# EAGLE design LCD_Backpack_1.8_TFT.v2 (EAGLE 5.07)
PROJECT: USB 1,8" TFT BREAKOUT V2
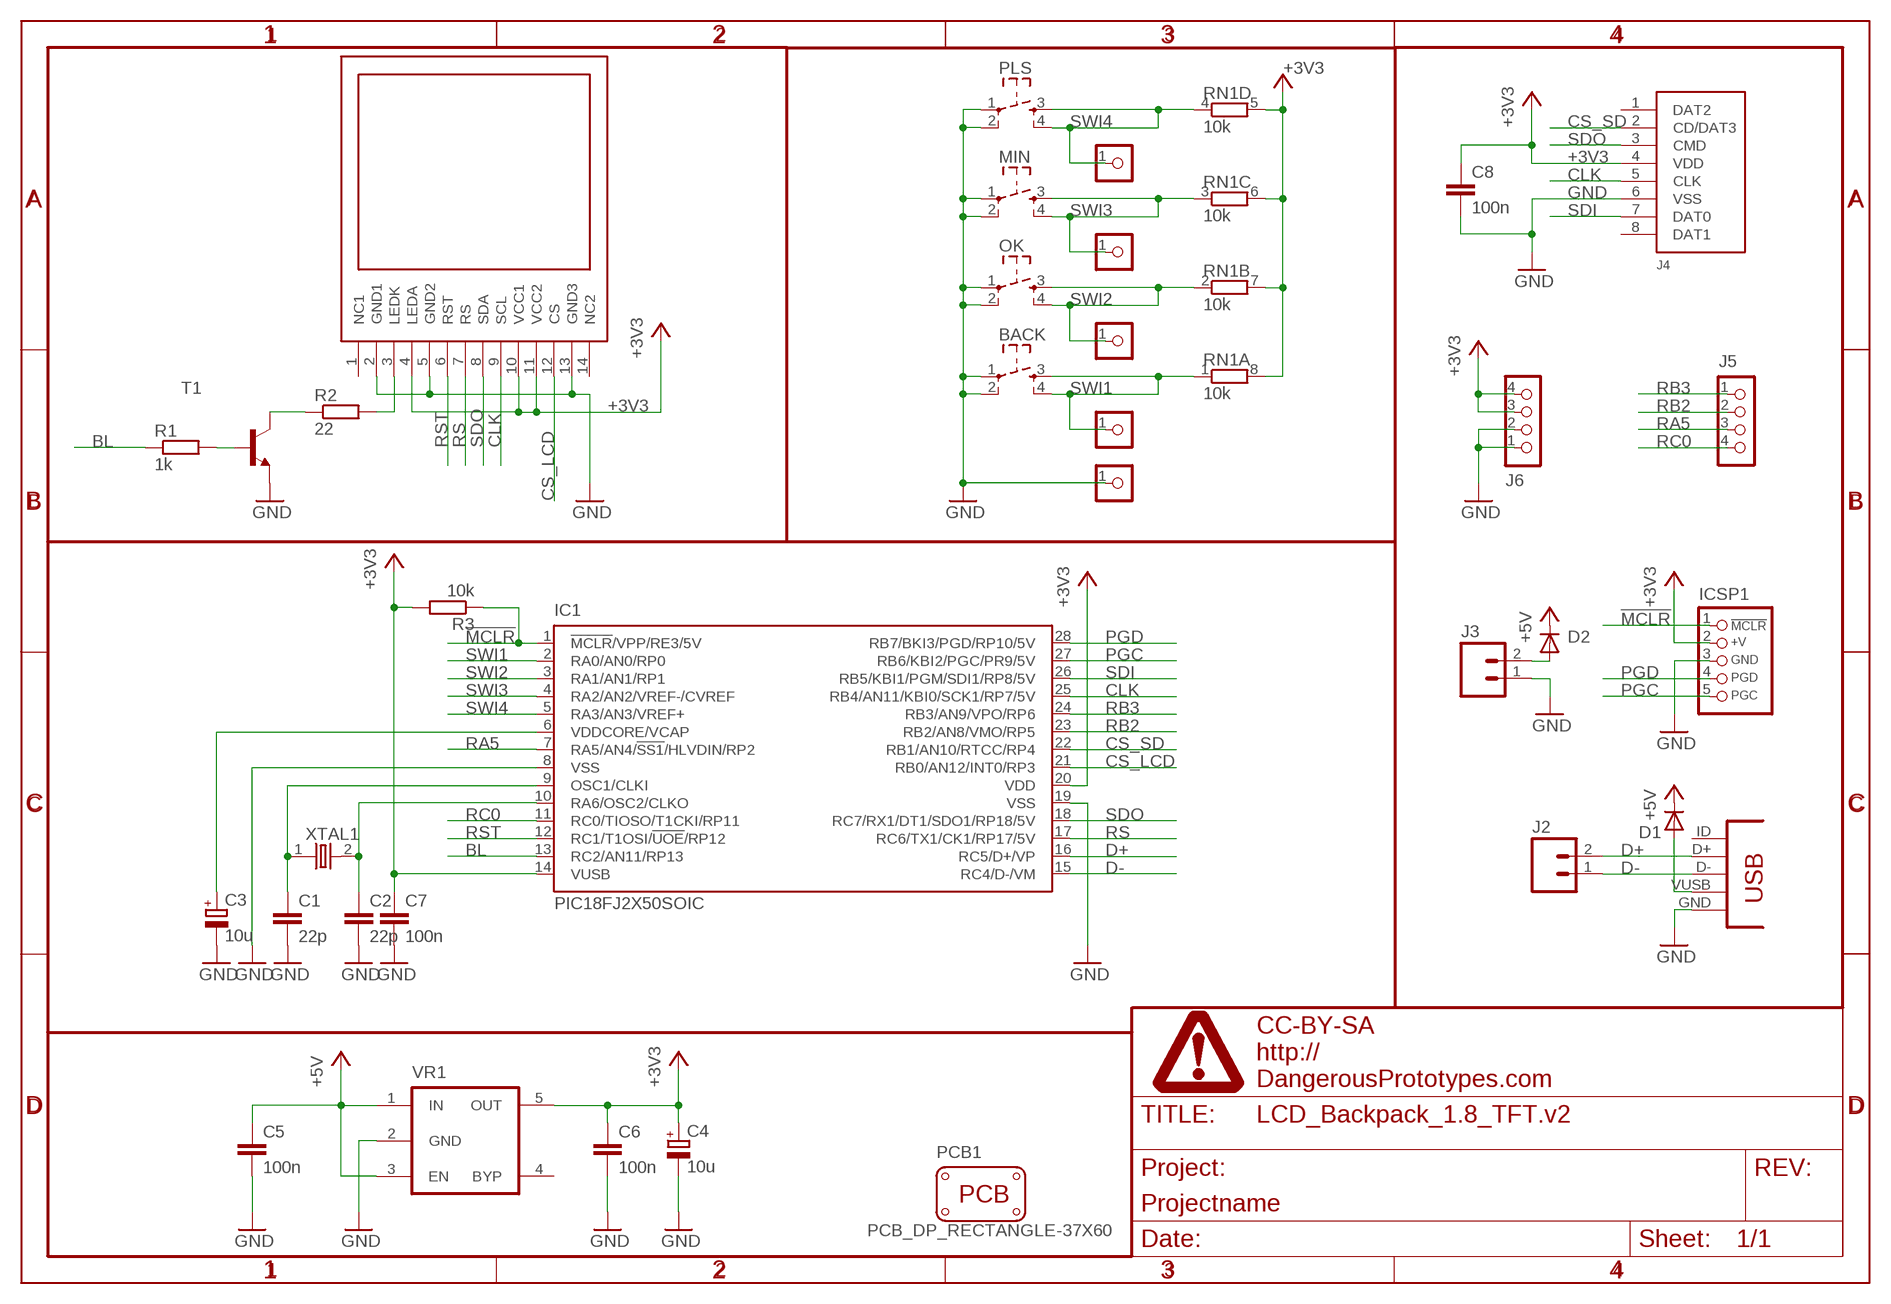
[diagram p0: schematic, sheet 1]

## Parts
BACK  SW_TACT_4P  [SW_TACT_SMALL]
C1  22p  CAPC603  [C603]
C2  22p  CAPC603  [C603]
C3  10u  CAP_POLSMC_A  [SMC_A]
C4  10u  CAP_POLSMC_A  [SMC_A]
C5  100n  CAPC603  [C603]
C6  100n  CAPC603  [C603]
C7  100n  CAPC603  [C603]
C8  100n  CAPC603  [C603]
D1  DIODE-SOD-123  [SOD-123]
D2  DIODE-SOD-123  [SOD-123]
IC1  PIC18FJ2X50SOIC  [SOIC28W]
ICSP1  HEADER_PRG_PIC_ICSPB  [HEADER_PRG_1X05_ICSP_B]
J1  CON-USB-MINI-BUSB1  [CONN_USB_MINI-B]
J2  M02PTH  [1X02]
J3  M02PTH  [1X02]
J4  CON_MICROSDHINGED  [CON_MICROSD_HINGED]
J5  CON_HEADER_1X04  [M1X4]
J6  CON_HEADER_1X04  [M1X4]
J7  CON_HEADER_1X01-PTH  [M1X1]
J8  CON_HEADER_1X01-PTH  [M1X1]
J9  CON_HEADER_1X01-PTH  [M1X1]
J10  CON_HEADER_1X01-PTH  [M1X1]
J11  CON_HEADER_1X01-PTH  [M1X1]
MIN  SW_TACT_4P  [SW_TACT_SMALL]
OK  SW_TACT_4P  [SW_TACT_SMALL]
PCB1  PCB_DP_RECTANGLE-37X60  [DP6037_V1]
PLS  SW_TACT_4P  [SW_TACT_SMALL]
R1  1k  RESISTORR603  [R603]
R2  22  RESISTORR603  [R603]
R3  10k  RESISTORR603  [R603]
RN1  10k  RNETWORK  [RN8P-4R-CRA06S]
T1  BJT-NPNSOT23BEC  [SOT23-BEC]
U$1  LCD18  [LCD18]
U$4  DINA4_L  [DP_LOGO]
VR1  MIC5205  [SOT-23-5]
XTAL1  OSC-XTAL  [HC-49U]

## Nets
!MCLR: IC1.1(!MCLR!/VPP/RE3/5V) ICSP1.1(/MCLR) R3.1
+3V3: C4.+ C6.1 C7.1 C8.1 IC1.14(VUSB) IC1.20(VDD) ICSP1.2(+V) J4.4(VDD) J6.3 J6.4 R3.2 RN1.5 RN1.6 RN1.7 RN1.8 U$1.4(LEDA) U$1.10(VCC1) U$1.11(VCC2) VR1.5(OUT)
+5V: C5.1 D1.C D2.C VR1.1(IN) VR1.3(EN)
BL: IC1.13(RC2/AN11/RP13) R1.1
CLK: IC1.25(RB4/AN11/KBI0/SCK1/RP7/5V) J4.5(CLK) U$1.9(SCL)
CS_LCD: IC1.21(RB0/AN12/INT0/RP3) U$1.12(CS)
CS_SD: IC1.22(RB1/AN10/RTCC/RP4) J4.2(CD/DAT3)
D+: IC1.16(RC5/D+/VP) J1.D+ J2.2
D-: IC1.15(RC4/D-/VM) J1.D- J2.1
GND: BACK.1 BACK.2 C1.2 C2.2 C3.- C4.- C5.2 C6.2 C7.2 C8.2 IC1.8(VSS) IC1.19(VSS) ICSP1.3(GND) J1.GND J3.1 J4.6(VSS) J6.1 J6.2 J11.1 MIN.1 MIN.2 OK.1 OK.2 PLS.1 PLS.2 T1.E U$1.2(GND1) U$1.5(GND2) U$1.13(GND3) VR1.2(GND)
N$1: C3.+ IC1.6(VDDCORE/VCAP)
N$2: D1.A J1.VUSB
N$3: D2.A J3.2
N$13: C1.1 IC1.9(OSC1/CLKI) XTAL1.1
N$14: C2.1 IC1.10(RA6/OSC2/CLKO) XTAL1.2
N$15: R2.1 T1.C
N$18: R2.2 U$1.3(LEDK)
N$19: R1.2 T1.B
PGC: IC1.27(RB6/KBI2/PGC/PR9/5V) ICSP1.5(PGC)
PGD: IC1.28(RB7/BKI3/PGD/RP10/5V) ICSP1.4(PGD)
RA5: IC1.7(RA5/AN4/!SS1!/HLVDIN/RP2) J5.3
RB2: IC1.23(RB2/AN8/VMO/RP5) J5.2
RB3: IC1.24(RB3/AN9/VPO/RP6) J5.1
RC0: IC1.11(RC0/TIOSO/T1CKI/RP11) J5.4
RS: IC1.17(RC6/TX1/CK1/RP17/5V) U$1.7(RS)
RST: IC1.12(RC1/T1OSI/!UOE!/RP12) U$1.6(RST)
SDI: IC1.26(RB5/KBI1/PGM/SDI1/RP8/5V) J4.7(DAT0)
SDO: IC1.18(RC7/RX1/DT1/SDO1/RP18/5V) J4.3(CMD) U$1.8(SDA)
SWI1: BACK.3 BACK.4 IC1.2(RA0/AN0/RP0) J10.1 RN1.1
SWI2: IC1.3(RA1/AN1/RP1) J9.1 OK.3 OK.4 RN1.2
SWI3: IC1.4(RA2/AN2/VREF-/CVREF) J8.1 MIN.3 MIN.4 RN1.3
SWI4: IC1.5(RA3/AN3/VREF+) J7.1 PLS.3 PLS.4 RN1.4
Unconnected: J1.BODY@1(BODY) J1.BODY@2(BODY) J1.BODY@3(BODY) J1.BODY@4(BODY) J1.ID(USBID) J4.1(DAT2) J4.8(DAT1) U$1.1(NC1) U$1.14(NC2) VR1.4(BYP)

## Library data of the parts
BACK MIN OK PLS = dp_devices:SW_TACT_4P
C1 C2 C5-C8 = dp_devices:CAP
C3 C4 = dp_devices:CAP_POL
D1 D2 = dp_devices:DIODE: Various Diode Packages
IC1 = dp_devices:PIC18FJ2X50
ICSP1 = dp_devices:HEADER_PRG_PIC_ICSP: 5-pin PIC In Circuit Serial Programming header
J1 = dp_devices:CON-USB-MINI-B: USB connector
J2 J3 = SparkFun2:M02: Header 2 Standard 2-pin 0.1" header. Use with straight break away headers (SKU : PRT-00116), right angle break away headers (PRT-00553), swiss pins (PRT-00743), machine pins (PRT-00117), and female headers (PRT-00115). Molex polarized connector foot print use with SKU : PRT-08233 with associated crimp pins and housings.
J4 = dp_devices:CON_MICROSD
J5 J6 = dp_devices:CON_HEADER_1X04
J7-J11 = dp_devices:CON_HEADER_1X01
PCB1 = dp_devices:PCB_DP_RECTANGLE: Dangerous Prototypes Standard Rectangular PCB sizes
R1-R3 = dp_devices:RESISTOR
RN1 = dp_devices:RNETWORK: 4 Resistor Array 0603
T1 = dp_devices:BJT-NPN: Most commonly used is SOT23-BEC
U$1 = lcd:LCD18
U$4 = dp_devices:DINA4_L: A4 DP frame Standard Dangerous Prototypes schematic frame. Automagically adds the DP logo and standard texts to the PCB Use the atrribute in the schematic editor to change the fields.; FF1: fulfillment by; FF2: Seeed Studio; FF3: www.seeedstudio.com; LICENSE: CC-BY-SA; PROJECT: Projectname; URL1: http://; URL2: DangerousPrototypes.com
VR1 = dp_devices:MIC5205: 150ma Low-Noise LDO Regulator
XTAL1 = dp_devices:OSC-XTAL

## Board
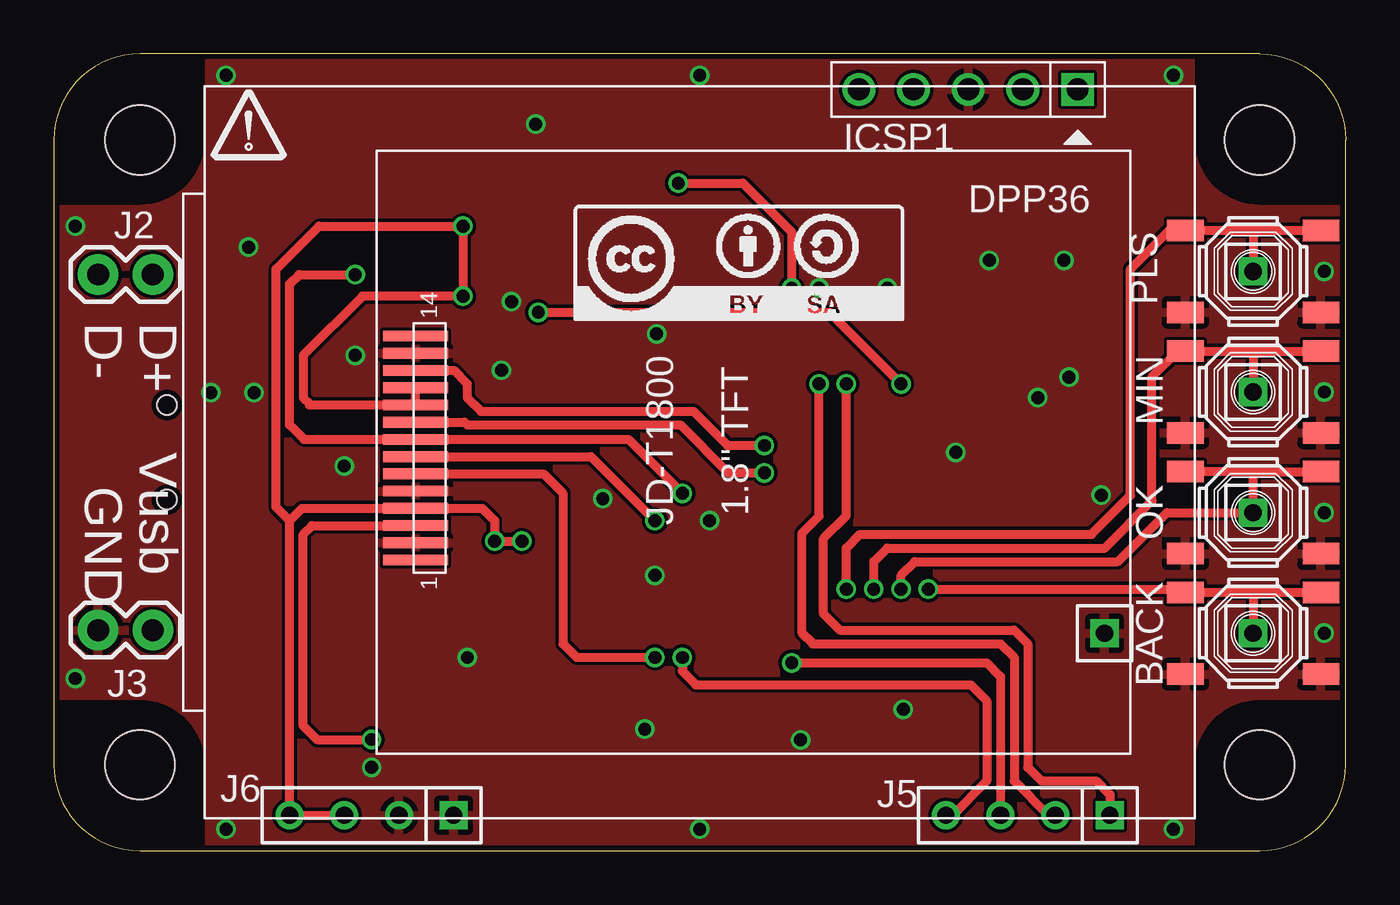
[diagram p1: board, top side]
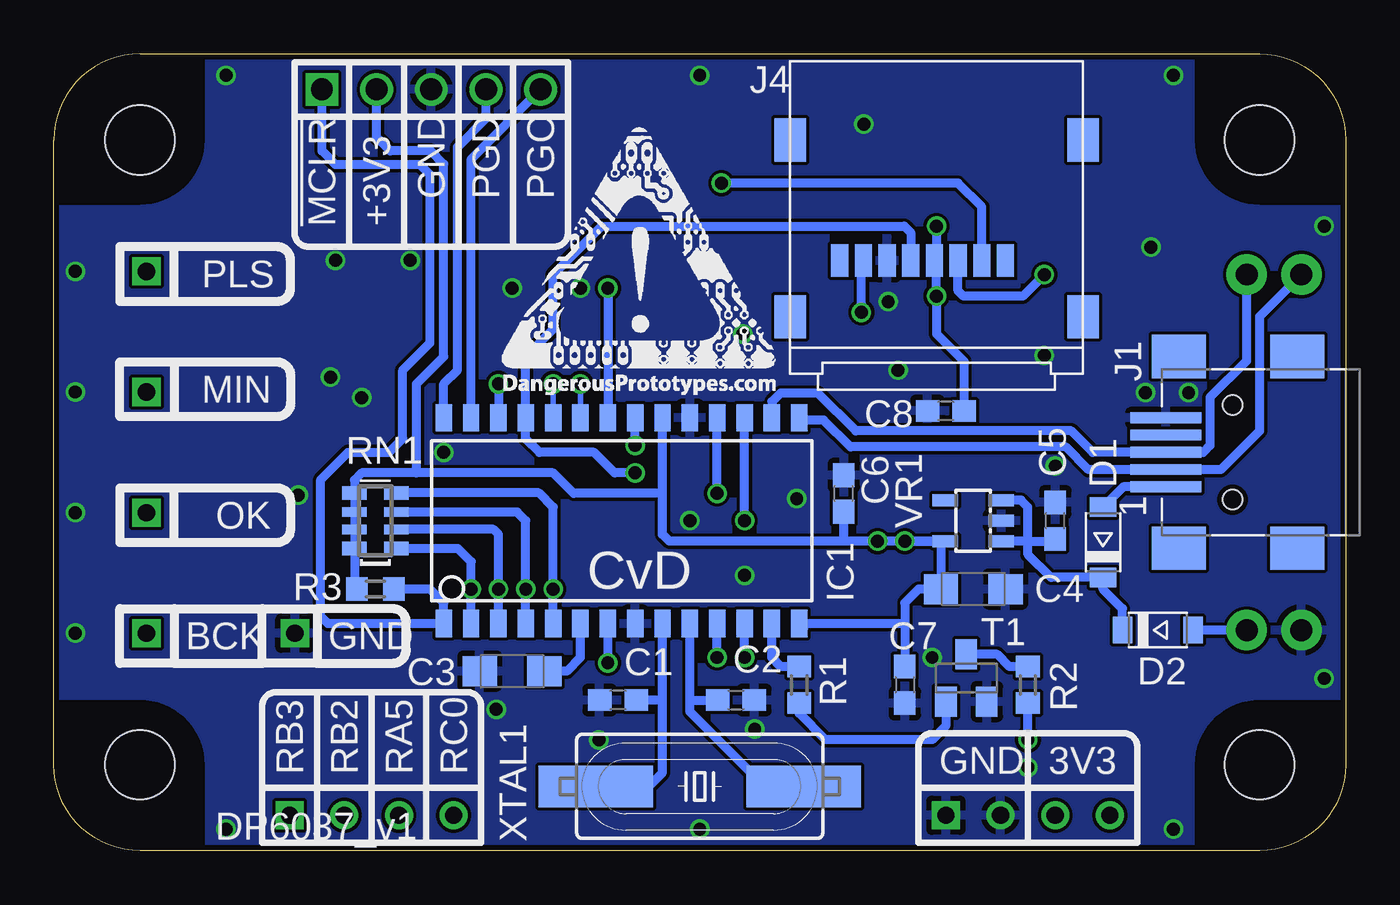
[diagram p2: board, bottom side, seen from below]

Size 60 x 37 mm. Coordinates in mm from the lower left corner, seen from the top.
Copper layers (1*16): Top 0.035mm / dielectric 1.5mm / Bottom 0.035mm
Design rules "Fusion_eagle_rule_v1.1": minimum track width 6mil, minimum drill 12mil, track to track 6mil, track to pad 6mil, pad to pad 6mil, via to via 6mil, smd to smd 0mil, copper to edge 10mil, drill to drill 10mil, minimum pad ring 10mil, minimum via ring 6mil, stop-mask expansion 2mil, vias tented up to drill 100mil, thermal gap 10mil

### Footprints (pad centres in the part's own frame; a part is rotated, then mirrored left to right if it is on the bottom)
SW_TACT_SMALL = smd 1.7 x 1: 1 -3.15,1.9; 2 3.15,1.9; 3 -3.15,-1.9; 4 3.15,-1.9
C603 = smd 1.1 x 1: 1 -0.85,0; 2 0.85,0
SMC_A = smd 1.6 x 1.4: + -1.5,0; - 1.5,0
SOD-123 = smd 0.91 x 1.22: A 1.635,0; C -1.635,0
SOIC28W = smd 0.762 x 1.27: 1 -8.89,-4.78; 2 -7.62,-4.78; 3 -6.35,-4.78; 4 -5.08,-4.78; 5 -3.81,-4.78; 6 -2.54,-4.78; 7 -1.27,-4.78; 8 0,-4.78; 9 1.27,-4.78; 10 2.54,-4.78; 11 3.81,-4.78; 12 5.08,-4.78; 13 6.35,-4.78; 14 7.62,-4.78; 15 7.62,4.78; 16 6.35,4.78; 17 5.08,4.78; 18 3.81,4.78; 19 2.54,4.78; 20 1.27,4.78; 21 0,4.78; 22 -1.27,4.78; 23 -2.54,4.78; 24 -3.81,4.78; 25 -5.08,4.78; 26 -6.35,4.78; 27 -7.62,4.78; 28 -8.89,4.78
HEADER_PRG_1X05_ICSP_B = drill 1.016 square: 1 -5.08,0 | drill 1.016 round: 2 -2.54,0; 3 0,0; 4 2.54,0; 5 5.08,0
CONN_USB_MINI-B = smd 2 x 2.5: BODY@1 -4.45,2.5; BODY@2 4.45,2.5; BODY@3 4.45,-3; BODY@4 -4.45,-3 | smd 0.5 x 3.3: D+ 0,3.1; D- -0.8,3.1; GND 1.6,3.1; ID 0.8,3.1; VUSB -1.6,3.1 | hole 0.9: -2.2,0; 2.2,0
1X02 = drill 1.016 pad 1.88 round: 1 0,0; 2 2.54,0
CON_MICROSD_HINGED = smd 0.8 x 1.5: 1 -3.2,2.6; 2 -2.1,2.6; 3 -1,2.6; 4 0.1,2.6; 5 1.2,2.6; 6 2.3,2.6; 7 3.4,2.6; 8 4.5,2.6 | smd 1.45 x 2: BODY@1 -6.8,5.2; BODY@2 -6.8,-3; BODY@3 6.8,-3; BODY@4 6.8,5.2
M1X4 = drill 0.8 square: 1 0,0 | drill 0.8 round: 2 2.54,0; 3 5.08,0; 4 7.62,0
M1X1 = drill 0.8 square: 1 0,0
DP6037_V1 = hole 3.2: 4,4; 56,4; 56,33; 4,33
R603 = smd 1 x 1.1: 1 -0.85,0; 2 0.85,0
RN8P-4R-CRA06S = smd 0.63 x 1.15: 1 -1.295,-0.975; 4 1.295,-0.975; 5 1.295,0.975; 8 -1.295,0.975 | smd 0.44 x 1.15: 2 -0.4,-0.975; 3 0.4,-0.975; 6 0.4,0.975; 7 -0.4,0.975
SOT23-BEC = smd 1 x 1.4: B -0.95,-1.1; C 0,1.1; E 0.95,-1.1
LCD18 = smd 3 x 0.5: 1 13.2,5; 2 13.2,4.2; 3 13.2,3.4; 4 13.2,2.6; 5 13.2,1.8; 6 13.2,1; 7 13.2,0.2; 8 13.2,-0.6; 9 13.2,-1.4; 10 13.2,-2.2; 11 13.2,-3; 12 13.2,-3.8; 13 13.2,-4.6; 14 13.2,-5.4
SOT-23-5 = smd 0.55 x 1.2: 1 -0.95,-1.3; 2 0,-1.3; 3 0.95,-1.3; 4 0.95,1.3; 5 -0.95,1.3
HC-49U = smd 5.334 x 1.93: 1 -4.826,0; 2 4.826,0

### Placement (x,y rotation side)
BACK  55.7,10.1 180 top
C1  33.8,7 180 bottom
C2  28.32,7 0 bottom
C3  38.72,8.34 180 bottom
C4  17.3,12.15 0 bottom
C5  13.49,15.32 90 bottom
C6  23.31,16.59 90 bottom
C7  20.48,7.71 270 bottom
C8  18.57,20.43 180 bottom
D1  11.27,14.32 90 bottom
D2  8.73,10.24 0 bottom
IC1  33,15.32 0 bottom
ICSP1  42.47,35.35 180 top
J1  5.25,18.5 90 bottom
J2  2.06,26.75 0 top
J3  2.06,10.24 0 top
J4  19,30 180 bottom
J5  49.05,1.65 180 top
J6  18.57,1.65 180 top
J7  55.7,26.9 0 top
J8  55.7,21.3 0 top
J9  55.7,15.7 0 top
J10  55.7,10.1 0 top
J11  48.8,10.1 0 top
MIN  55.7,21.3 180 top
OK  55.7,15.7 180 top
PCB1  0,0 0 top
PLS  55.7,26.9 180 top
R1  25.38,7.71 270 bottom
R2  14.76,7.71 270 bottom
R3  45.06,12.15 180 bottom
RN1  45.06,15.32 90 bottom
T1  17.62,8.02 0 bottom
U$1  30,18.5 180 top
U$2  [DP_LOGO_ART_0.5X0.5]  39.16,21.2 0 bottom
U$3  [CC-BY-SA]  24.16,24.63 0 top
U$4  9.04,32.69 0 top
VR1  17.3,15.32 90 bottom
XTAL1  30,2.99 0 bottom

### Tracks (layer width: path | path; a pad name or v marks a point on that pad's centre or on a via)
!MCLR
  Bottom 0.406: R3.1 42.52,12.15 41.89,11.52 IC1.1 47.27,10.54 47.6,10.88 47.6,17.23 46.34,18.5 44.43,18.5 43.8,19.14 43.8,22.31 42.52,23.58 42.52,31.38 43,31.86 46.91,31.86 47.55,32.49 ICSP1.1
+3V3  (via drill 0.6)
  Top 0.406: U$1.11 U$1.10 11.88,20.7 11.88,20.75 11.59,21.04 11.59,23 14.34,25.75 v19,25.75 v19,29 12.31,29 10.31,27 10.31,15.96 10.95,15.32 | J6.3 J6.4 10.95,15.32 | v21.75,14.37 v20.48,14.37 20.48,15.32 19.9,15.9 U$1.4 11.53,15.9 10.95,15.32
  Bottom 0.406: 25.16,10.33 IC1.14 20.48,10.54 | VR1.5 18.57,14.35 | 31.73,16.59 IC1.20 | 31.73,16.59 31.73,14.69 31.41,14.38 23.75,14.38 23.31,14.38 | 20.48,10.54 C7.1 | 20.48,10.54 20.48,11.52 19.84,12.15 C4.+ 18.8,14.18 VR1.5 | R3.2 46.04,12.28 RN1.8 RN1.7 RN1.6 RN1.5 46.04,17.21 45.7,17.55 43.16,17.55 | 43.16,17.55 36.81,17.55 35.86,16.59 31.73,16.59 | 43.16,17.55 43.16,21.68 41.89,22.95 41.89,31.88 42.5,32.49 44.38,32.49 45.01,33.12 ICSP1.2 | VR1.5 23.31,14.38 | v20.48,14.37 VR1.5 | 19,27.3 v19,25.75 19,24 17.72,22.72 C8.1 | 19,27.3 J4.4 | v19,29 19,27.3 | 23.31,14.38 C6.1
+5V
  Bottom 0.406: 14.76,14.38 VR1.1 | 14.76,14.38 13.59,14.38 C5.1 | VR1.3 15.07,16.27 14.76,15.96 14.76,14.38 | D2.C 10.36,11.24 11.27,12.15 D1.C 13.69,12.69 14.75,13.75 14.75,14.37 14.76,14.38
BL
  Bottom 0.406: IC1.13 26.65,8.97 26.23,8.55 R1.1
CLK  (via drill 0.6)
  Top 0.406: U$1.9 19.07,19.9 19.2,19.77 29.09,19.77 31.32,17.55 v33,17.55
  Bottom 0.406: v33,17.55 33.95,17.55 34.91,18.5 37.45,18.5 38.08,19.14 IC1.25 38.08,22.95 36.81,24.21 36.81,26.75 34.56,29 20.5,29 20.2,28.7 J4.5
CS_LCD  (via drill 0.6)
  Top 0.406: U$1.12 18.58,22.3 19.2,21.68 19.2,21.04 19.84,20.41 29.7,20.41 31.29,18.82 v33,18.82
  Bottom 0.406: v33,18.82 IC1.21
CS_SD  (via drill 0.6)
  Top 0.406: v34.27,26.12 34.27,28.73 32,31 v29,31
  Bottom 0.406: v34.27,26.12 IC1.22 | v29,31 18,31 16.9,29.9 J4.2
D+
  Bottom 0.406: J2.2 4.6,22.75 6.3,21.05 6.3,18.82 6.62,18.5 J1.D+ 11.75,18.5 12.75,19.5 22.75,19.5 24.5,21.25 26.25,21.25 26.65,20.85 IC1.16
D-
  Bottom 0.406: IC1.15 25.27,20 24.25,20 23,18.75 13,18.75 11.95,17.7 J1.D- 5.8,17.7 4,19.5 4,24.82 J2.1
GND  (via drill 0.6)
  other vias: 19.2,8.97 59,10.1 59,21.3 59,15.7 59,26.9 35.54,26.12 28,24 38.72,26.12 25.5,16.34 52,36 21.25,25.5 1,8 8,1 52,1 1,29 8,36 9.04,28.02 43.45,27.41 46.91,27.41 47.15,21.99 45.7,21.04 30,1 27.45,5.65 14.76,3.88 48.65,16.51 39.46,6.57 30,36 22.38,33.74 30.46,15.32 27.92,12.79 41.89,18.5 13.49,17.86 20.79,22.31 34.68,5.15 14,23 9.29,21.27 7.29,21.27
  pour Bottom: 60,0 60,37 0,37 0,0
  pour Top: 60,0 60,37 0,37 0,0
N$1
  Bottom 0.406: IC1.6 35.54,8.97 36.17,8.34 C3.+
N$2
  Bottom 0.406: J1.VUSB 10.33,16.9 D1.A
N$3
  Bottom 0.406: J3.2 D2.A
N$13
  Bottom 0.406: 31.73,7 31.73,3.62 32.37,2.99 XTAL1.1 | 31.73,7 IC1.9 | 31.73,7 C1.1
N$14
  Bottom 0.406: XTAL1.2 26.82,2.99 27.34,3.5 27.5,3.5 30.46,6.46 30.46,7 | 30.46,7 IC1.10 | 30.46,7 C2.1
N$15
  Bottom 0.406: T1.C 16.18,9.12 15.61,8.55 R2.1
N$18  (via drill 0.6)
  Top 0.406: U$1.3 11.99,15.1 11.59,14.69 11.59,5.8 12.22,5.17 v14.76,5.17
  Bottom 0.406: v14.76,5.17 R2.2
N$19
  Bottom 0.406: T1.B 18.57,5.8 19.2,5.17 24.16,5.17 25.38,6.38 R1.2
PGC
  Bottom 0.406: IC1.27 40.62,32.12 ICSP1.5
PGD
  Bottom 0.406: IC1.28 41.89,21.68 41.26,22.31 41.26,32.67 39.93,34 ICSP1.4
RA5  (via drill 0.6)
  Top 0.406: v34.27,8.72 43.34,8.72 43.97,8.09 J5.3
  Bottom 0.406: v34.27,8.72 IC1.7
RB2  (via drill 0.6)
  Top 0.406: J5.2 46.19,1.65 44.6,3.24 44.6,8.97 43.97,9.61 35.25,9.61 34.75,10.11 34.75,14.75 35.54,15.54 v35.54,21.68
  Bottom 0.254: v35.54,21.68 IC1.23
RB3  (via drill 0.6)
  Top 0.406: J5.1 49.05,2.6 48.41,3.24 45.88,3.24 45.24,3.88 45.24,9.61 44.6,10.24 36.5,10.24 35.75,10.99 35.75,14.5 36.81,15.56 v36.81,21.68
  Bottom 0.254: v36.81,21.68 IC1.24
RC0  (via drill 0.6)
  Top 0.406: J5.4 41.75,1.65 43.34,3.24 43.34,6.96 42.59,7.71 29.82,7.71 29.19,8.34 v29.19,8.97
  Bottom 0.406: v29.19,8.97 IC1.11
RS  (via drill 0.6)
  Top 0.406: U$1.7 24.95,18.3 v27.92,15.32
  Bottom 0.406: v27.92,15.32 IC1.17
RST  (via drill 0.6)
  Top 0.406: U$1.6 22.75,17.5 23.65,16.59 23.65,9.61 24.29,8.97 v27.92,8.97
  Bottom 0.406: v27.92,8.97 IC1.12
SDI  (via drill 0.6)
  Top 0.406: v39.35,21.68 36.02,25 v22.5,25
  Bottom 0.406: v39.35,21.68 IC1.26 | v22.5,25 22.5,27.3 J4.7
SDO  (via drill 0.6)
  Top 0.406: v14,26.75 11.38,26.75 10.95,26.32 10.95,19.77 11.62,19.1 U$1.8 26.68,19.1 v29.19,16.59
  Bottom 0.406: v29.19,16.59 IC1.18 | J4.3 18,26 17.75,25.75 15,25.75 v14,26.75
SWI1  (via drill 0.6)
  Top 0.406: 55.7,12 BACK.4 52.4,12.15 v40.62,12.15 | 55.7,12 J10.1 | 55.7,12 BACK.3
  Bottom 0.406: IC1.2 v40.62,12.15 40.62,13.42 41.23,14.03 RN1.1
SWI2  (via drill 0.6)
  Top 0.406: v39.35,12.15 39.35,12.79 39.98,13.42 49.42,13.42 51.7,15.7 J9.1 55.7,17.6 | 55.7,17.6 OK.4 | 55.7,17.6 OK.3
  Bottom 0.406: IC1.3 v39.35,12.15 39.35,14.69 39.59,14.93 RN1.2
SWI3  (via drill 0.6)
  Top 0.406: v38.08,12.15 38.08,13.42 38.72,14.05 48.8,14.05 51,16.25 51,22 52.2,23.2 MIN.4 55.7,23.2 | 55.7,23.2 J8.1 | 55.7,23.2 MIN.3
  Bottom 0.406: IC1.4 v38.08,12.15 38.08,15.32 38.48,15.72 RN1.3
SWI4  (via drill 0.6)
  Top 0.406: v36.81,12.15 36.81,14.05 37.45,14.69 48.19,14.69 50,16.5 50,27 51.8,28.8 PLS.4 55.7,28.8 | 55.7,28.8 J7.1 | 55.7,28.8 PLS.3
  Bottom 0.406: IC1.5 v36.81,12.15 36.81,15.96 37.47,16.62 RN1.4

### Text on the board
tPlace: DPP36 | D- | D+ | Vusb | GND
bPlace: PGC | PGD | GND | +3V3 | !MCLR | PLS | MIN | OK | CvD | GND | BCK | 3V3 | GND | RC0 | RA5 | RB2 | RB3